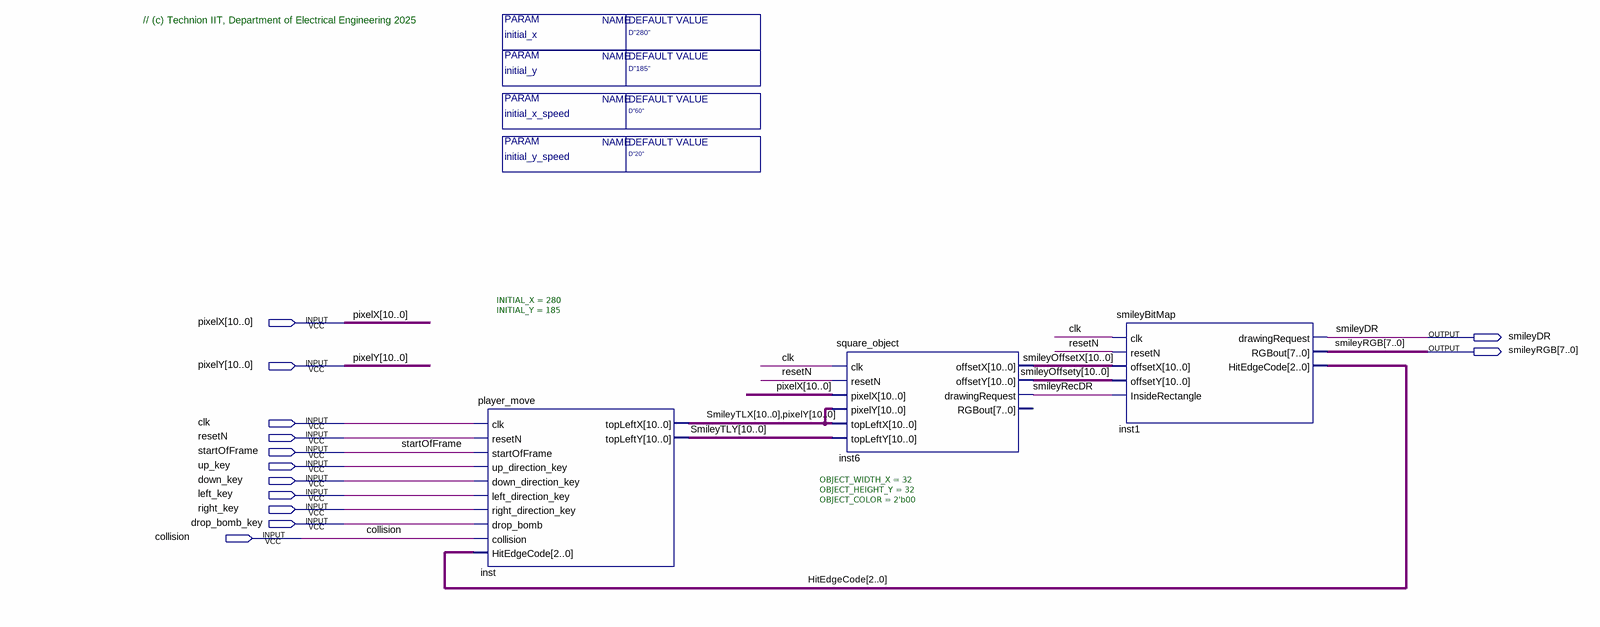
[diagram p0: schematic sheet]
// Quartus schematic Smiley_Block_T.bdf as structural Verilog: 3 symbols, 13 pins
module Smiley_Block_T #(parameter initial_x = "D\"280\"", parameter initial_y = "D\"185\"", parameter initial_x_speed = "D\"60\"", parameter initial_y_speed = "D\"20\"") (
  input  [10:0] pixelX,
  input  [10:0] pixelY,
  input  clk,
  input  resetN,
  input  startOfFrame,
  input  up_key,
  input  down_key,
  input  left_key,
  input  right_key,
  input  drop_bomb_key,
  input  collision,
  output smileyDR,
  output [7:0] smileyRGB
);

  wire smileyRecDR;
  wire [2:0] HitEdgeCode;
  wire [10:0] smileyOffsetX, smileyOffsety, SmileyTLX, SmileyTLY;

  player_move #(.INITIAL_X(280), .INITIAL_Y(185)) inst (
    .clk(clk), .resetN(resetN), .startOfFrame(startOfFrame), .up_direction_key(up_key),
    .down_direction_key(down_key), .left_direction_key(left_key), .right_direction_key(right_key),
    .drop_bomb(drop_bomb_key), .collision(collision), .HitEdgeCode(HitEdgeCode),
    .topLeftX({SmileyTLX, pixelY}), .topLeftY(SmileyTLY));
  square_object #(.OBJECT_WIDTH_X(32), .OBJECT_HEIGHT_Y(32), .OBJECT_COLOR(2'b00)) inst6 (
    .clk(clk), .resetN(resetN), .pixelX(pixelX), .pixelY({SmileyTLX, pixelY}),
    .topLeftX({SmileyTLX, pixelY}), .topLeftY(SmileyTLY), .offsetX(smileyOffsetX), .offsetY(smileyOffsety),
    .drawingRequest(smileyRecDR));  // open: RGBout
  smileyBitMap inst1 (
    .clk(clk), .resetN(resetN), .offsetX(smileyOffsetX), .offsetY(smileyOffsety),
    .InsideRectangle(smileyRecDR), .drawingRequest(smileyDR), .RGBout(smileyRGB), .HitEdgeCode(HitEdgeCode));

  // Notes on the sheet:
  //   // (c) Technion IIT, Department of Electrical Engineering 2025
endmodule
